# Altium schematic sheet PCIE.SchDoc: PCIe Bus
size 420 x 297 mm; SheetNumber: 12
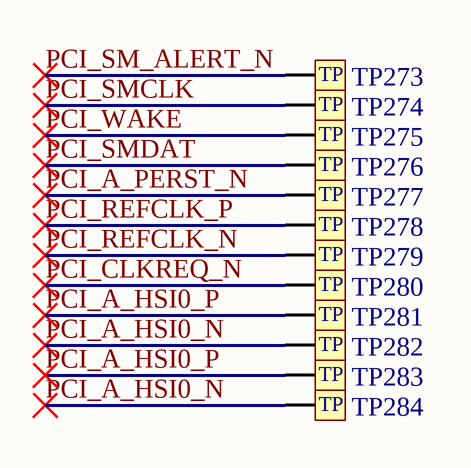
[diagram p0: PCIE.SchDoc]

## Parts
TP273  TP_0P8MM  [TP_0P8MM]  (value not drawn)  (no BOM)
TP274  TP_0P8MM  [TP_0P8MM]  (value not drawn)  (no BOM)
TP275  TP_0P8MM  [TP_0P8MM]  (value not drawn)  (no BOM)
TP276  TP_0P8MM  [TP_0P8MM]  (value not drawn)  (no BOM)
TP277  TP_0P8MM  [TP_0P8MM]  (value not drawn)  (no BOM)
TP278  TP_0P8MM  [TP_0P8MM]  (value not drawn)  (no BOM)
TP279  TP_0P8MM  [TP_0P8MM]  (value not drawn)  (no BOM)
TP280  TP_0P8MM  [TP_0P8MM]  (value not drawn)  (no BOM)
TP281  TP_0P8MM  [TP_0P8MM]  (value not drawn)  (no BOM)
TP282  TP_0P8MM  [TP_0P8MM]  (value not drawn)  (no BOM)
TP283  TP_0P8MM  [TP_0P8MM]  (value not drawn)  (no BOM)
TP284  TP_0P8MM  [TP_0P8MM]  (value not drawn)  (no BOM)

## Nets
PCI_A_HSI0_N: TP282.1 TP284.1
PCI_A_HSI0_P: TP281.1 TP283.1
PCI_A_PERST_N: TP277.1
PCI_CLKREQ_N: TP280.1
PCI_REFCLK_N: TP279.1
PCI_REFCLK_P: TP278.1
PCI_SM_ALERT_N: TP273.1
PCI_SMCLK: TP274.1
PCI_SMDAT: TP276.1
PCI_WAKE: TP275.1

## Notes on the sheet
- PROJECT
- SIZE
- FILE NAME
- A3
- TITLE
- SHEET
- OF
- REV
- (in symbol TP_0P8MM) TP

## Library data of the parts
TP273-TP284 = TP_0P8MM: OSM Footprint 0P8 LGA Ball